# EasyEDA Pro project lceda_pro_3plus_2.4.epro

# Schematic sch_main_2
Create Date: 2023-11-15; Page Name: P1; Project Name: 多功能宏键盘 3Plus 【V2版本】; Schematic Name: sch_main_2; Update Date: 2023-11-27; Add into BOM: yes; Company: M0dular; Convert to PCB: yes; Drawed: 嘉立创EDA; Page Size: A3; Part Number: JLCPCB-001; Reviewed: 嘉立创EDA; Version: 2.4
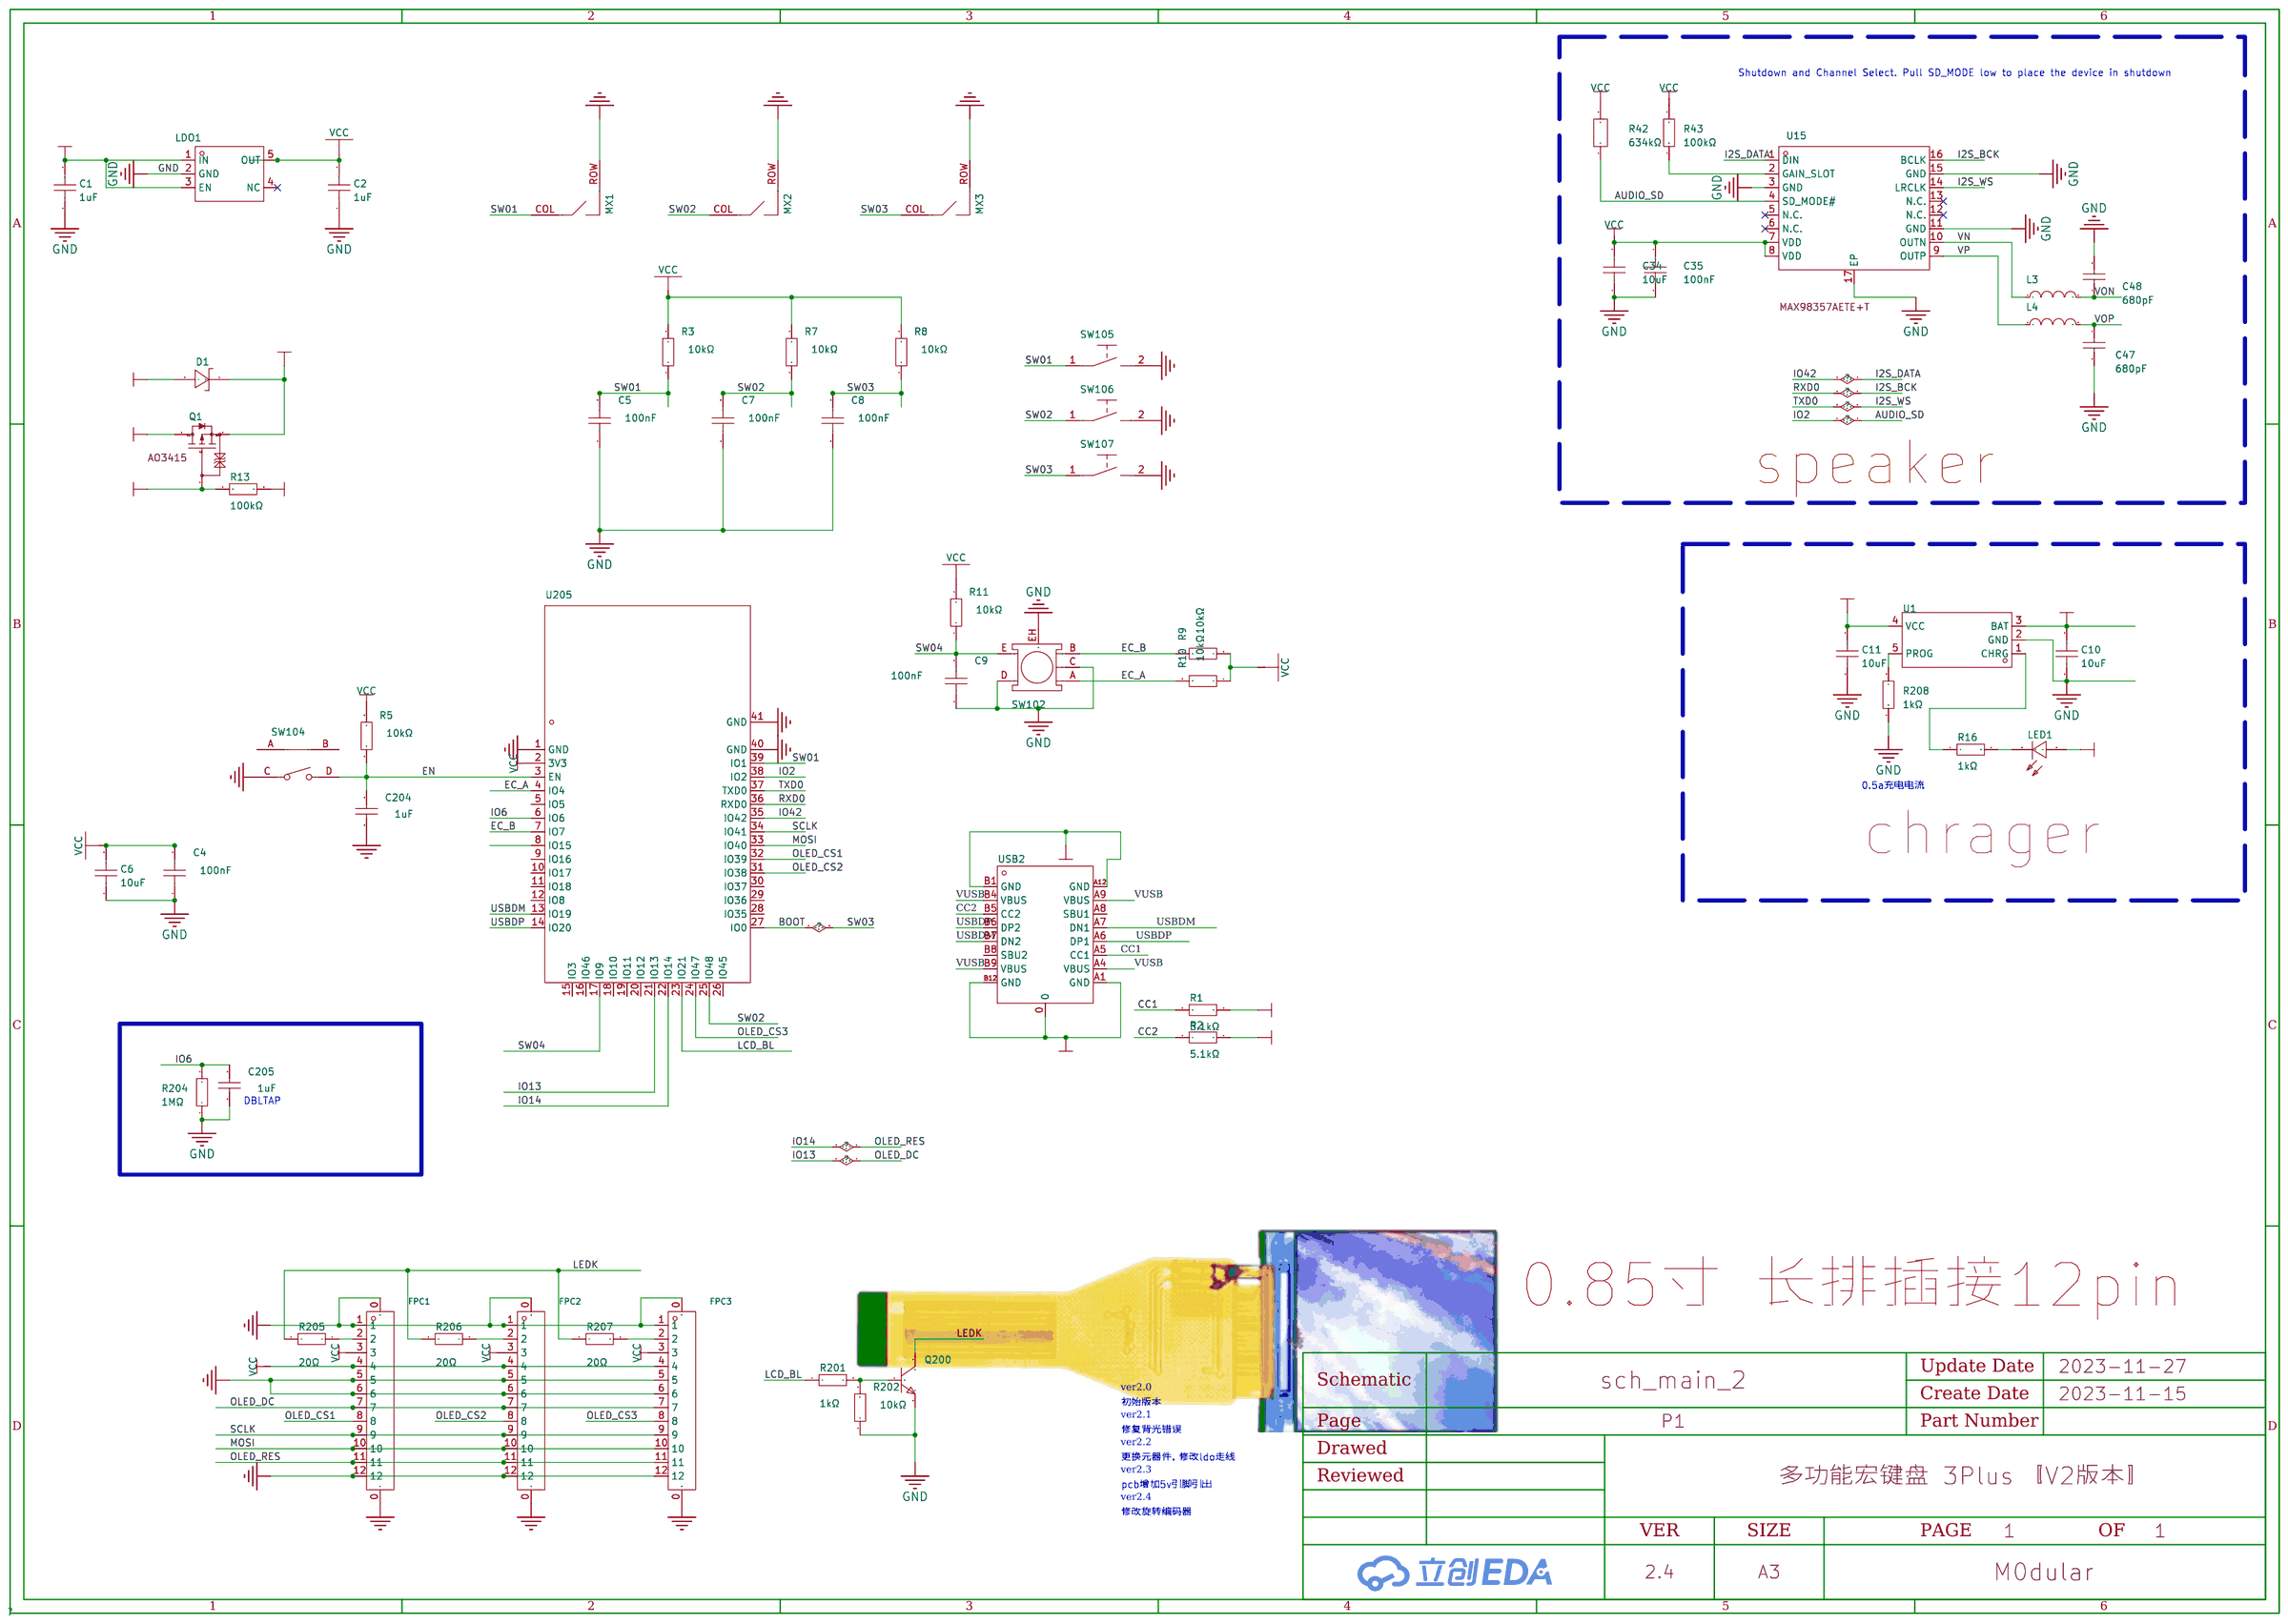
[diagram p0: schematic sheet]

## Parts
C1  1uF  [C0603]
C2  1uF  [C0603]
C4  100nF  [C0603]
C5  100nF  [C0603]
C6  10uF  [C0603]
C7  100nF  [C0603]
C8  100nF  [C0603]
C9  100nF  [C0603]
C10  10uF  [C0603]
C11  10uF  [C0603]
C34  10uF  [C0603]
C35  100nF  [C0603]
C47  680pF  [C0603]
C48  680pF  [C0603]
C204  1uF  [C0603]
C205  1uF  [C0603]
D1  -  [sod-323_l1.8-w1.3-ls2.5-rd]
FPC1  AFC42-S12FMA-1H  [CONN-SMD_12P-P0.50_L3.1-W8.0]
FPC2  AFC42-S12FMA-1H  [CONN-SMD_12P-P0.50_L3.1-W8.0]
FPC3  AFC42-S12FMA-1H  [CONN-SMD_12P-P0.50_L3.1-W8.0]
L3  BLM18SG331TN1D  [L0603]
L4  BLM18SG331TN1D  [L0603]
LDO1  TLV75733PDBVR  [SOT-23-5_L3.0-W1.7-P0.95-LS2.8-BR]
LED1  -  [LED0603-R-RD]
MX1  CPG151101S11-16  [CherryMX(KHS)-1.00U]
MX2  CPG151101S11-16  [CherryMX(KHS)-1.00U]
MX3  CPG151101S11-16  [CherryMX(KHS)-1.00U]
Q1  -  [sot-23-3_l2.9-w1.3-p1.90-ls2.4-br]
Q200  -  [SOT-23-3_L2.9-W1.3-P1.90-LS2.4-BR]
R1  5.1kΩ  [R0603]
R2  5.1kΩ  [R0603]
R3  10kΩ  [R0603]  (no BOM)
R5  10kΩ  [R0603]
R7  10kΩ  [R0603]  (no BOM)
R8  10kΩ  [R0603]  (no BOM)
R9  10kΩ  [R0603]
R10  10kΩ  [R0603]
R11  10kΩ  [R0603]  (no BOM)
R13  100kΩ  [R0603]
R16  1kΩ  [R0603]
R42  634kΩ  [R0603]
R43  100kΩ  [R0603]
R201  1kΩ  [R0603]
R202  10kΩ  [R0603]
R204  1MΩ  [R0603]
R205  20Ω  [R0603]
R206  20Ω  [R0603]
R207  20Ω  [R0603]
R208  1kΩ  [R0603]
SW102  EC11J1524413  [SW-SMD_EC11J1524413]
SW104  TS36CA-0.6  [SW-SMD_TS36CA]
SW105  CPG151101S13  [KEY-TH_CPG1511F01S0X]
SW106  CPG151101S13  [KEY-TH_CPG1511F01S0X]
SW107  CPG151101S13  [KEY-TH_CPG1511F01S0X]
U1  -  [SOT-23-5_L3.0-W1.7-P0.95-LS2.8-BR]
U15  MAX98357AETE+T  [TQFN-16_L3.0-W3.0-P0.50-BL-EP1.5]
U205  ESP32-S3-WROOM-1-N8R2  [WIRELM-SMD_ESP32-S3-WROOM-1]
USB2  -  [USB-C_SMD-TYPE-C-31-M-12]

## Library data of the parts
C1 C2 = CL10A105KB8NNNC: 容值:1uF;精度:±10%;额定电压:50V;材质(温度系数):X5R;; LCSC Part Name: 1uF ±10% 50V; Supplier Part: C15849; Manufacturer: SAMSUNG(三星); Supplier Footprint: 0603; JLCPCB Part Class: Basic Part; Datasheet: https://atta.szlcsc.com/upload/public/pdf/source/20160103/1457707679084.pdf; Supplier: LCSC; Tolerance: ±10%; Voltage Rated: 50V; Temperature Coefficient: X5R
C4 C5 C7-C9 = CL10B104KB8NNNC: 容值:100nF;精度:±10%;额定电压:50V;温度系数:X7R;; LCSC Part Name: 100nF ±10% 50V; Supplier Part: C1591; Manufacturer: SAMSUNG(三星); Supplier Footprint: 0603; JLCPCB Part Class: Extended Part; Datasheet: https://atta.szlcsc.com/upload/public/pdf/source/20160103/1457707680512.pdf; Supplier: LCSC; Tolerance: ±10%; Voltage Rated: 50V; Temperature Coefficient: X7R
C6 C10 C11 = CL10A106KP8NNNC: 容值:10uF;精度:±10%;额定电压:10V;温度系数:X5R;; LCSC Part Name: 10uF ±10% 10V; Supplier Part: C19702; Manufacturer: SAMSUNG(三星); Supplier Footprint: 0603; JLCPCB Part Class: Basic Part; Datasheet: https://atta.szlcsc.com/upload/public/pdf/source/20160103/1457707703378.pdf; Supplier: LCSC; Tolerance: ±10%; Voltage Rated: 10V; Temperature Coefficient: X5R
C34 = CL10A106KP8NNNC: 容值:10uF;精度:±10%;额定电压:10V;材质(温度系数):X5R;; LCSC Part Name: 10uF ±10% 10V; Supplier Part: C19702; Manufacturer: SAMSUNG(三星); Supplier Footprint: 0603; JLCPCB Part Class: Basic Part; Datasheet: https://atta.szlcsc.com/upload/public/pdf/source/20160103/1457707703378.pdf; Supplier: LCSC; Tolerance: ±10%; Voltage Rated: 10V; Temperature Coefficient: X5R
C35 = CL10B104KB8NNNC: 容值:100nF;精度:±10%;额定电压:50V;材质(温度系数):X7R;; LCSC Part Name: 100nF ±10% 50V; Supplier Part: C1591; Manufacturer: SAMSUNG(三星); Supplier Footprint: 0603; JLCPCB Part Class: Extended Part; Datasheet: https://atta.szlcsc.com/upload/public/pdf/source/20160218/1457707763339.pdf; Supplier: LCSC; Tolerance: ±10%; Voltage Rated: 50V; Temperature Coefficient: X7R
C47 C48 = 0603B681K500NT: 容值:680pF;精度:±10%;额定电压:50V;材质(温度系数):X7R;; LCSC Part Name: 680pF ±10% 50V; Supplier Part: C1630; Manufacturer: FH(风华); Supplier Footprint: 0603; JLCPCB Part Class: Basic Part; Datasheet: https://atta.szlcsc.com/upload/public/pdf/source/20170923/C1630_1506149298238988425.pdf; Supplier: LCSC; Tolerance: ±10%; Voltage Rated: 50V; Temperature Coefficient: X7R
C204 C205 = CL10A105KB8NNNC: 温度系数:X5R;精度:±10%;额定电压:50V;容值:1uF;; LCSC Part Name: 1uF(105) ±10% 50V; Supplier Part: C15849; Manufacturer: SAMSUNG(三星); Supplier Footprint: 0603; JLCPCB Part Class: Basic Part; Datasheet: https://atta.szlcsc.com/upload/public/pdf/source/20160103/1457707679084.pdf; Supplier: LCSC; Temperature Coefficient: X5R; Tolerance: ±10%; Voltage Rated: 50V
D1 = 1N5819WS: 直流反向耐压(Vr):40V;平均整流电流(Io):1A;正向压降(Vf):600mV@1A;; LCSC Part Name: 40V 1A 600mV@1A; Supplier Part: C191023; Manufacturer: Hottech(合科泰); Supplier Footprint: SOD-323; JLCPCB Part Class: Basic Part; Datasheet: https://atta.szlcsc.com/upload/public/pdf/source/20180614/C191023_3C6A6398B911F3A4C23E7538EE054643.pdf; Supplier: LCSC; Reverse Voltage (Vr): 40V; Average Rectified Current (Io): 1A; Forward Voltage (Vf@If): 600mV@1A
FPC1-FPC3 = AFC42-S12FMA-1H: 间距:0.5mm;触点数量:12;锁定特性:翻盖式;安装类型:卧贴;触点类型:双侧触点/上下接;; LCSC Part Name: FFC FPC连接器 0.5MM间距 12P 前插后翻 H1.0mm 双面接 镀金; Supplier Part: C466532; Manufacturer: JS(钜硕电子); Supplier Footprint: SMD,P=0.5mm; JLCPCB Part Class: 扩展库; Supplier: LCSC; Pitch: 0.5mm; Number of Contacts: 12; Locking Feature: 翻盖式; Mounting Type: 卧贴; Contact Type: 双侧触点/上下接; Height Above Board: 1mm; FFC, FCB Thickness: 0.3mm
L3 L4 = BLM18SG331TN1D: 标称阻抗@测试频率:330Ω@100MHz;误差:±25%;直流电阻(RDC):70mΩ;; LCSC Part Name: 单路 0603磁珠 阻抗330Ω@100MHz; Supplier Part: C88989; Manufacturer: muRata(村田); Supplier Footprint: 0603; JLCPCB Part Class: Extended Part; Datasheet: https://atta.szlcsc.com/upload/public/pdf/source/20180326/C88989_E77110ECB70599E5C39DB4FE82EA7FD9.pdf; Supplier: LCSC; Impedance @ Frequency: 330Ω@100MHz; Tolerance: ±25%; DC Resistance: 70mΩ; Current Rating: 1.5A; Circuits: 1
LDO1 = TLV75733PDBVR: 输出类型:固定;输出极性:正;输出通道数:1;最大输入电压:5.5V;输出电压:3.3V;压差:475mV@(1A);输出电流:1A;电源纹波抑制比(PSRR):52dB;; LCSC Part Name: 正 Vin=5.5V Vout=3.3V 1A 52dB; Supplier Part: C485517; Manufacturer: TI(德州仪器); Supplier Footprint: SOT-23-5; JLCPCB Part Class: Extended Part; Datasheet: https://atta.szlcsc.com/upload/public/pdf/source/20200225/C485517_6B29D09EDAFD9A781E45EE8E3C6E09A4.pdf; Supplier: LCSC; Output Type: 固定; Output Polarity: 正; Number of Outputs: 1; Maximum Input Voltage: 5.5V; Output Voltage: 3.3V; Dropout Voltage: 475mV@(1A); Output Current: 1A; Power Supply Rejection Ratio (PSRR): 52dB; Power Supply Rejection Ratio (PRSS): 70dB@(1kHz),62dB@(10kHz)
LED1 = 19-217/R6C-AL1M2VY/3T: 发光颜色:红灯;二极管配置:-;透镜颜色:无色透明;主波长:617.5nm;峰值波长:632nm;色温:-;光通量(25时):-;测试电流:5mA;正向电压(VF):2.2V;发光强度:28.5mcd;功率:60mW;发光角度:120°;安装方式:-;工作温度:-40~+85;; LCSC Part Name: 红灯; Supplier Part: C72044; Manufacturer: EVERLIGHT(台湾亿光); Supplier Footprint: 0603; JLCPCB Part Class: Extended Part; Datasheet: https://atta.szlcsc.com/upload/public/pdf/source/20160507/1462613613821.pdf; Supplier: LCSC; Emitted Color: 红灯; Lens Color: 无色透明; Dominant Wavelength: 617.5nm; Peak Wavelength: 632nm; Forward Current: 5mA; Forward Voltage (VF): 2.2V; Luminous Intensity: 28.5mcd; Power Dissipation: 60mW; Viewing Angle: 120°; Operating Temperature: -40~+85
MX1-MX3 = CPG151101S11-16: 轴类型:-;工作电压:2V~12V;操作力:-;触底力:-;触发行程:-;总行程:-;针脚数:-;机械寿命:-;工作温度:-;; Supplier Part: C5156480; Manufacturer: Kailh(凯华); JLCPCB Part Class: Extended Part; Datasheet: https://atta.szlcsc.com/upload/public/pdf/source/20220829/33DFC1A320A078D20879F2B21562B513.pdf; Supplier: LCSC; Operating Voltage: 2V~12V
Q1 = AO3415_C181094: 类型:P沟道;漏源电压(Vdss):20V;连续漏极电流(Id):4A;功率(Pd):1.5W;导通电阻(RDS(on)@Vgs,Id):41mΩ@4.5V,4A;阈值电压(Vgs(th)@Id):900mV@250A;; LCSC Part Name: P沟道 20V 4A; Supplier Part: C181094; Manufacturer: Hottech(合科泰); Manufacturer Part: AO3415; Supplier Footprint: SOT-23(SOT-23-3); JLCPCB Part Class: Extended Part; Datasheet: https://atta.szlcsc.com/upload/public/pdf/source/20180131/C181094_15173931965481329223.pdf; Supplier: LCSC; Type: P沟道; Drain Source Voltage (Vdss): 20V; Continuous Drain Current (Id): 4A; Power Dissipation (Pd): 1.5W; Drain Source On Resistance (RDS(on)@Vgs,Id): 41mΩ@4.5V,4A; Gate Threshold Voltage (Vgs(th)@Id): 900mV@250A
Q200 = SS8050 Y1 200-350 .: 集电极电流(Ic):1.5A;功率(Pd):300mW;晶体管类型:NPN;集射极击穿电压(Vceo):25V;; LCSC Part Name: SS8050Y1200-350.; Supplier Part: C2150; Manufacturer: CJ（江苏长电/长晶）; Manufacturer Part: SS8050; LCSC Stock: 138539; LCSC On Sale: 1; Supplier Footprint: SOT-23(SOT-23-3); Price: 0.126; JLCPCB Part Class: BasicPart; JLCPCB Stock: 708469; JLCPCB On Sale: 1; Datasheet: https://atta.szlcsc.com/upload/public/pdf/source/20140809/1457707209319.pdf; Supplier: LCSC; Collector Current (Ic): 1.5A; Power Dissipation (Pd): 300mW; Transistor Type: NPN; Collector-Emitter Breakdown Voltage (Vceo): 25V
R1 R2 = 0603WAF5101T5E: 电阻类型:厚膜电阻;阻值:5.1kΩ;精度:±1%;功率:1/10W;温度系数:±100ppm/;最大工作电压:75V;工作温度范围:-55~+155;; LCSC Part Name: 5.1kΩ ±1%; Supplier Part: C23186; Manufacturer: UNI-ROYAL(厚声); Supplier Footprint: 0603; JLCPCB Part Class: Basic Part; Datasheet: https://atta.szlcsc.com/upload/public/pdf/source/20200306/C422600_1E6D84923E4A46A82E41ADD87F860B5C.pdf; Supplier: LCSC; Type: 厚膜电阻; Tolerance: ±1%; Power(Watts): 1/10W; Temperature Coefficient: ±100ppm/; Overload Voltage (Max): 75V; Operating Temperature Range: -55~+155
R3 R5 R7-R11 = 0603WAF1002T5E: 电阻类型:厚膜电阻;阻值:10kΩ;精度:±1%;功率:1/10W;温度系数:±100ppm/;最大工作电压:75V;工作温度范围:-55~+155;; LCSC Part Name: 10kΩ ±1% 1/10W; Supplier Part: C25804; Manufacturer: UNI-ROYAL(厚声); Supplier Footprint: 0603; JLCPCB Part Class: Basic Part; Datasheet: https://atta.szlcsc.com/upload/public/pdf/source/20200306/C422600_1E6D84923E4A46A82E41ADD87F860B5C.pdf; Supplier: LCSC; Type: 厚膜电阻; Tolerance: ±1%; Power(Watts): 1/10W; Temperature Coefficient: ±100ppm/; Overload Voltage (Max): 75V; Operating Temperature Range: -55~+155
R13 R43 = 0603WAF1003T5E: 精度:±1%;阻值:100kΩ;温度系数:±100ppm/;功率:1/10W;最大工作电压:75V;工作温度范围:-55~+155;; LCSC Part Name: 100KΩ ±1%; Supplier Part: C25803; Manufacturer: UNI-ROYAL(厚声); Supplier Footprint: 0603; JLCPCB Part Class: Basic Part; Datasheet: https://atta.szlcsc.com/upload/public/pdf/source/20170920/C25803_1505901551039983376.pdf; Supplier: LCSC; Tolerance: ±1%; Temperature Coefficient: ±100ppm/; Power(Watts): 1/10W; Overload Voltage (Max): 75V; Operating Temperature Range: -55~+155
R16 R201 R208 = 0603WAF1001T5E: 电阻类型:厚膜电阻;阻值:1kΩ;精度:±1%;功率:1/10W;温度系数:±100ppm/;最大工作电压:75V;工作温度范围:-55~+155;; LCSC Part Name: 1kΩ ±1% 1/10W; Supplier Part: C21190; Manufacturer: UNI-ROYAL(厚声); Supplier Footprint: 0603; JLCPCB Part Class: Basic Part; Datasheet: https://atta.szlcsc.com/upload/public/pdf/source/20200306/C422600_1E6D84923E4A46A82E41ADD87F860B5C.pdf; Supplier: LCSC; Type: 厚膜电阻; Tolerance: ±1%; Power(Watts): 1/10W; Temperature Coefficient: ±100ppm/; Overload Voltage (Max): 75V; Operating Temperature Range: -55~+155
R42 = RC0603FR-07634KL: 电阻类型:厚膜电阻;阻值:634kΩ;精度:±1%;功率:100mW;; LCSC Part Name: 634kΩ ±1% 100mW; Supplier Part: C273753; Manufacturer: YAGEO(国巨); Supplier Footprint: 0603; JLCPCB Part Class: Extended Part; Datasheet: https://atta.szlcsc.com/upload/public/pdf/source/20191125/C273753_901BC2F8FEE117E6429E5D997CD78CF2.pdf; Supplier: LCSC; Type: 厚膜电阻; Tolerance: ±1%; Power(Watts): 100mW; Temperature Coefficient: ±100ppm/℃; Overload Voltage (Max): 75V; Operating Temperature Range: -55℃~+155℃
R202 = 0603WAF1002T5E: 电阻类型:厚膜电阻;阻值:10kΩ;精度:±1%;功率:100mW;; LCSC Part Name: 厚膜电阻 10kΩ ±1% 100mW; Supplier Part: C25804; Manufacturer: UNI-ROYAL(厚声); Supplier Footprint: 0603; JLCPCB Part Class: Basic Part; Datasheet: https://atta.szlcsc.com/upload/public/pdf/source/20200306/C422600_1E6D84923E4A46A82E41ADD87F860B5C.pdf; Supplier: LCSC; Type: 厚膜电阻; Tolerance: ±1%; Power(Watts): 100mW; Temperature Coefficient: ±100ppm/℃; Overload Voltage (Max): 75V; Operating Temperature Range: -55℃~+155℃
R204 = 0603WAF1004T5E: 电阻类型:厚膜电阻;阻值:1MΩ;精度:±1%;功率:100mW;; LCSC Part Name: 1MΩ ±1% 100mW; Supplier Part: C22935; Manufacturer: UNI-ROYAL(厚声); Supplier Footprint: 0603; JLCPCB Part Class: 基础库; Datasheet: https://atta.szlcsc.com/upload/public/pdf/source/20200306/C422600_1E6D84923E4A46A82E41ADD87F860B5C.pdf; Supplier: LCSC; Type: 厚膜电阻; Tolerance: ±1%; Power(Watts): 100mW; Temperature Coefficient: ±100ppm/℃; Overload Voltage (Max): 75V; Operating Temperature Range: -55℃~+155℃
R205-R207 = 0603WAF200JT5E: 电阻类型:厚膜电阻;阻值:20Ω;精度:±1%;功率:100mW;温度系数:±100ppm/℃;; LCSC Part Name: 厚膜电阻 20Ω ±1% 100mW; Supplier Part: C22950; Manufacturer: UNI-ROYAL(厚声); Supplier Footprint: 0603; JLCPCB Part Class: Basic Part; Datasheet: https://atta.szlcsc.com/upload/public/pdf/source/20200306/C422600_1E6D84923E4A46A82E41ADD87F860B5C.pdf; Supplier: LCSC; Type: 厚膜电阻; Tolerance: ±1%; Power(Watts): 100mW; Temperature Coefficient: ±100ppm/℃; Overload Voltage (Max): 75V; Operating Temperature Range: -55℃~+155℃
SW102 = EC11J1524413: Supplier Part: C470592; Manufacturer: ALPSALPINE(阿尔卑斯阿尔派); Supplier Footprint: SMD; JLCPCB Part Class: 扩展库; Datasheet: https://atta.szlcsc.com/upload/public/pdf/source/20191216/C470795_DE763ECE59BD49533DB26DB53E5D34B2.pdf; Supplier: LCSC
SW104 = TS36CA-0.6: 触点电流:50mA;额定电压(DC):12V;绝缘电阻:100MΩ;电路结构:单刀单掷;安装方式:卧贴;按钮形状:矩形按钮;按钮/盖帽颜色:黑色;作用力:250gf@±50gf;机械寿命:30000;工作温度:-20℃~+70℃;引脚样式:SMD接片;开关高度:3.5mm;; LCSC Part Name: 轻触开关 3*6*3.5侧按 直径0.6定位柱 白体黑头 250力度; Supplier Part: C2681481; Manufacturer: SHOU HAN(首韩); Supplier Footprint: SMD; JLCPCB Part Class: 扩展库; Datasheet: https://atta.szlcsc.com/upload/public/pdf/source/20210122/C2681481_EC49E45AE97AC1474E58FB36E84EF19B.pdf; Supplier: LCSC; Contact Current: 50mA; Voltage Rating (DC): 12V; Insulation Resistance: 100MΩ; Circuit: 单刀单掷; Mounting Style: 卧贴; Actuator Style: 矩形按钮; Actuator/Cap Color: 黑色; Operating Force: 250gf@±50gf; Mechanical Life: 30000; Operating Temperature: -20℃~+70℃; Pin Style: SMD接片; Switch Height: 3.5mm
SW105-SW107 = CPG151101S13: 轴类型:青轴;工作电压:2V~12V;操作力:50gf@±10gf;针脚数:2;; LCSC Part Name: KT 青轴; Supplier Part: C404353; Manufacturer: Kailh(凯华); Supplier Footprint: 插件; JLCPCB Part Class: 扩展库; Datasheet: https://atta.szlcsc.com/upload/public/pdf/source/20190830/C404353_03D773C25064FB6981E6251E455188E4.pdf; Supplier: LCSC; Axis Type: 青轴; Operating Voltage: 2V~12V; Operation Force: 50gf@±10gf; Tactile Force: 60gf@±10gf; Conduction Travel: 1.9mm; Total Travel: 4mm; Pin: 2; Mechanical Life: 7000万次; Operating Temperature: -10℃~+70℃
U1 = TP4054-42-SOT25R: 充电电池的类型:-;电池单元组数:-;最大充电电流:-;充满的电池组电压:-;最大供应电压:-;; Supplier Part: C32574; Manufacturer: TOPPOWER(南京拓微); Supplier Footprint: SOT-23-5; JLCPCB Part Class: Basic Part; Datasheet: https://atta.szlcsc.com/upload/public/pdf/source/20140621/1457707095588.pdf; Supplier: LCSC
U15 = MAX98357AETE+T: 功放类型:-;输出功率:-;; Supplier Part: C910544; Manufacturer: ADI(亚德诺)/MAXIM(美信); Supplier Footprint: TQFN-16-EP(3x3); JLCPCB Part Class: Extended Part; Datasheet: https://atta.szlcsc.com/upload/public/pdf/source/20210106/C910544_CB6DE4B2CEE254A72E6BDB40E718D281.pdf; Supplier: LCSC
U205 = ESP32-S3-WROOM-1-N8R2: Supplier Part: C2913204; Manufacturer: ESPRESSIF(乐鑫); Supplier Footprint: SMD,18x25.5mm; JLCPCB Part Class: Extended Part; Datasheet: https://atta.szlcsc.com/upload/public/pdf/source/20220628/A2AC12B3C87735CAEB7EBE2DBE80936C.pdf; Supplier: LCSC
USB2 = USB-TYPE-C-018: 连接器类型:Type-C;标准:-;公母:母座;触点数量:16;端口数量:1;安装方式:卧贴;额定电流 - 电源:3A;工作温度范围:-25~+85;; Supplier Part: C2927038; Manufacturer: DEALON(德艺隆); Supplier Footprint: SMD; JLCPCB Part Class: Extended Part; Datasheet: https://atta.szlcsc.com/upload/public/pdf/source/20211217/CCD3D517E355E8E0CC52ABD8D5784AD8.pdf; Supplier: LCSC; Connector Type: Type-C; Gender: 母座; Number of Contacts: 16; Number of Ports: 1; Mounting Style: 卧贴; Current Rating - Power (Max): 3A; Operating Temperature Range: -25~+85

## Nets
GND: C1.1 C2.1 C4.1 C5.1 C6.1 C7.1 C8.1 C9.1 C10.1 C11.1 C34.1 C35.2 C47.1 C48.2 C204.1 C205.1 FPC1.0 FPC1.1 FPC1.5 FPC1.6 FPC1.12 FPC2.0 FPC2.1 FPC2.5 FPC2.6 FPC2.12 FPC3.0 FPC3.1 FPC3.5 FPC3.6 FPC3.12 LDO1.2(GND) MX1.ROW MX2.ROW MX3.ROW Q200.2(E) R1.2 R2.2 R13.2 R202.1 R204.1 R208.1 SW102.C SW102.D SW102.EH SW104.C SW105.2 SW106.2 SW107.2 U1.2(GND) U15.3(GND) U15.11(GND) U15.15(GND) U15.17(EP) U205.1(GND) U205.40(GND) U205.41(GND) USB2.0 USB2.A1(GND) USB2.A12(GND) USB2.B1(GND) USB2.B12(GND)
VBAT: C10.2 Q1.3(D) U1.3(BAT)
VCC: C2.2 C4.2 C6.2 C34.2 C35.1 FPC1.3 FPC1.4 FPC2.3 FPC2.4 FPC3.3 FPC3.4 LDO1.5(OUT) R3.2 R5.2 R7.2 R8.2 R9.1 R10.1 R11.2 R42.2 R43.2 U15.7(VDD) U15.8(VDD) U205.2(3V3)
AUDIO_SD: R42.1 U15.4(SD_MODE#) U205.38(IO2)
BOOT: C8.2 MX3.COL R8.1 SW107.1 U205.27(IO0)
CC1: R1.1 USB2.A5(CC1)
CC2: R2.1 USB2.B5(CC2)
EC_A: R10.2 SW102.A U205.4(IO4)
EC_B: R9.2 SW102.B U205.7(IO7)
EN: C204.2 R5.1 SW104.D U205.3(EN)
I2S_BCK: U15.16(BCLK) U205.36(RXD0)
I2S_DATA: U15.1(DIN) U205.35(IO42)
I2S_WS: U15.14(LRCLK) U205.37(TXD0)
IO6: C205.2 R204.2 U205.6(IO6)
IO13: FPC1.7 FPC2.7 FPC3.7 U205.21(IO13)
IO14: FPC1.11 FPC2.11 FPC3.11 U205.22(IO14)
LCD_BL: R201.1 U205.23(IO21)
LEDK: Q200.3(C) R205.1 R206.1 R207.1
MOSI: FPC1.10 FPC2.10 FPC3.10 U205.33(IO40)
OLED_CS1: FPC1.8 U205.32(IO39)
OLED_CS2: FPC2.8 U205.31(IO38)
OLED_CS3: FPC3.8 U205.24(IO47)
SCLK: FPC1.9 FPC2.9 FPC3.9 U205.34(IO41)
SW01: C5.2 MX1.COL R3.1 SW105.1 U205.39(IO1)
SW02: C7.2 MX2.COL R7.1 SW106.1 U205.25(IO48)
SW04: C9.2 R11.1 SW102.E U205.17(IO9)
USBDM: U205.13(IO19) USB2.A7(DN1) USB2.B7(DN2)
USBDP: U205.14(IO20) USB2.A6(DP1) USB2.B6(DP2)
VN: L3.1 U15.10(OUTN)
VON: C48.1 L3.2
VOP: C47.2 L4.2
VP: L4.1 U15.9(OUTP)
VSYS: C1.2 D1.1(C) LDO1.1(IN) LDO1.3(EN) Q1.2(S)
VUSB: C11.2 D1.2(A) LED1.1(A) Q1.1(G) R13.1 U1.4(VCC) USB2.A4(VBUS) USB2.A9(VBUS) USB2.B4(VBUS) USB2.B9(VBUS)
$1N48640: R208.2 U1.5(PROG)
$1N76182: R16.1 U1.1(CHRG)
$1N95276: Q200.1(B) R201.2 R202.2
$1N109191: R43.1 U15.2(GAIN_SLOT)
$1N112073: LED1.2(C) R16.2
$1N122714: FPC3.2 R207.2
$1N122760: FPC2.2 R206.2
$1N122794: FPC1.2 R205.2

Not connected (* = marked no-connect by the designer): LDO1 4(NC)*; SW104 A B; U15 5(N.C.)* 6(N.C.)* 12(N.C.)* 13(N.C.)*; U205 5(IO5) 8(IO15) 9(IO16) 10(IO17) 11(IO18) 12(IO8) 15(IO3) 16(IO46) 18(IO10) 19(IO11) 20(IO12) 26(IO45) 28(IO35) 29(IO36) 30(IO37); USB2 A8(SBU1) B8(SBU2)

## Notes on the sheet
- Shutdown and Channel Select. Pull SD_MODE low to place the device in shutdown
- speaker
- 0.5a充电电流
- chrager
- DBLTAP
- 0.85寸 长排插接12pin
- ver2.0
- 初始版本
- ver2.1
- 修复背光错误
- ver2.2
- 更换元器件，修改ldo走线
- pcb增加5v引脚引出
- ver2.3
- ver2.4
- 修改旋转编码器

# Board pcb_main_2
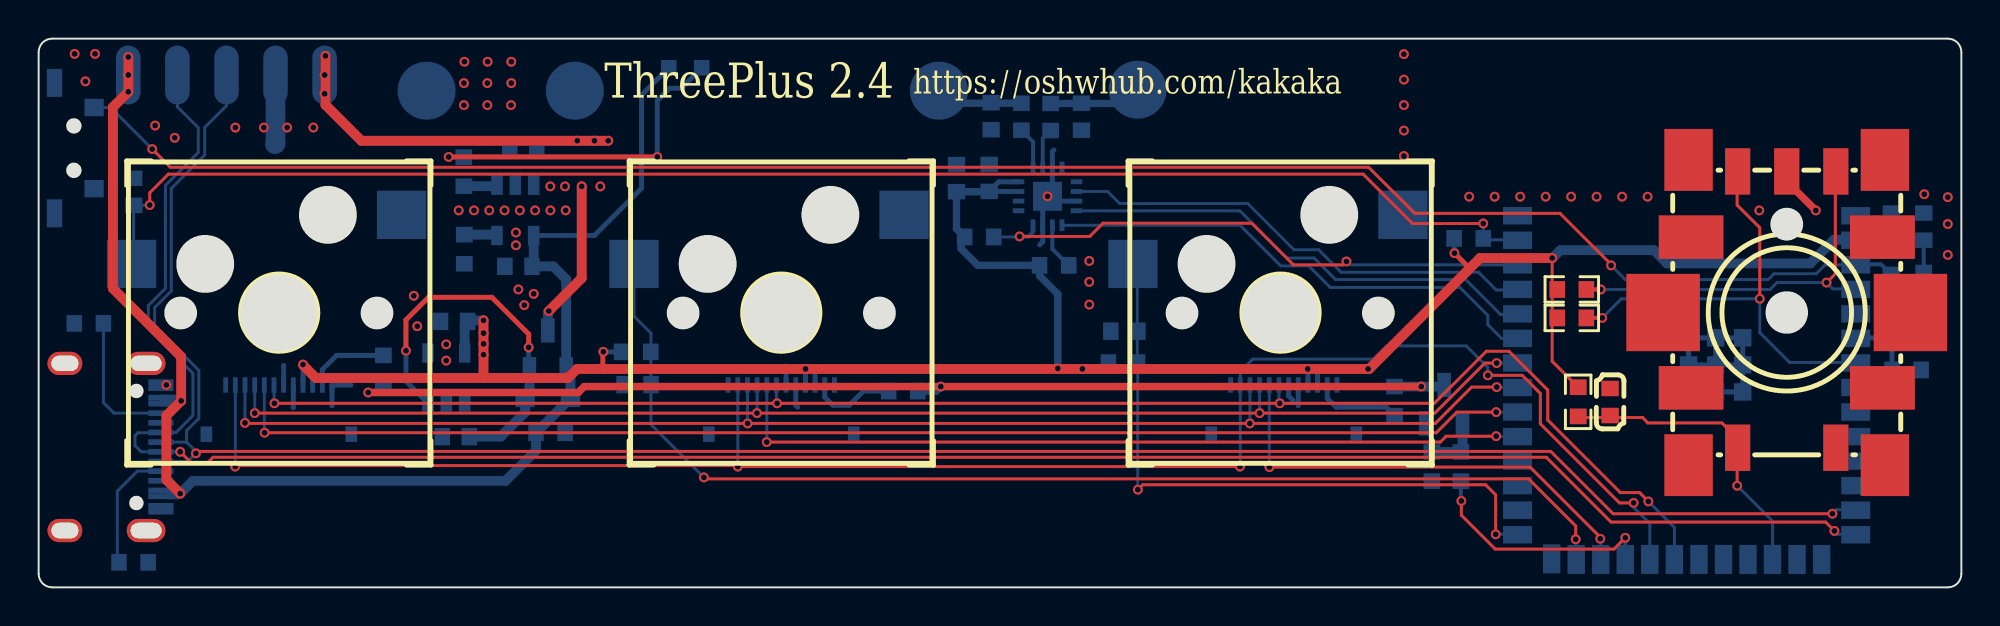
[diagram p1: board, top side]
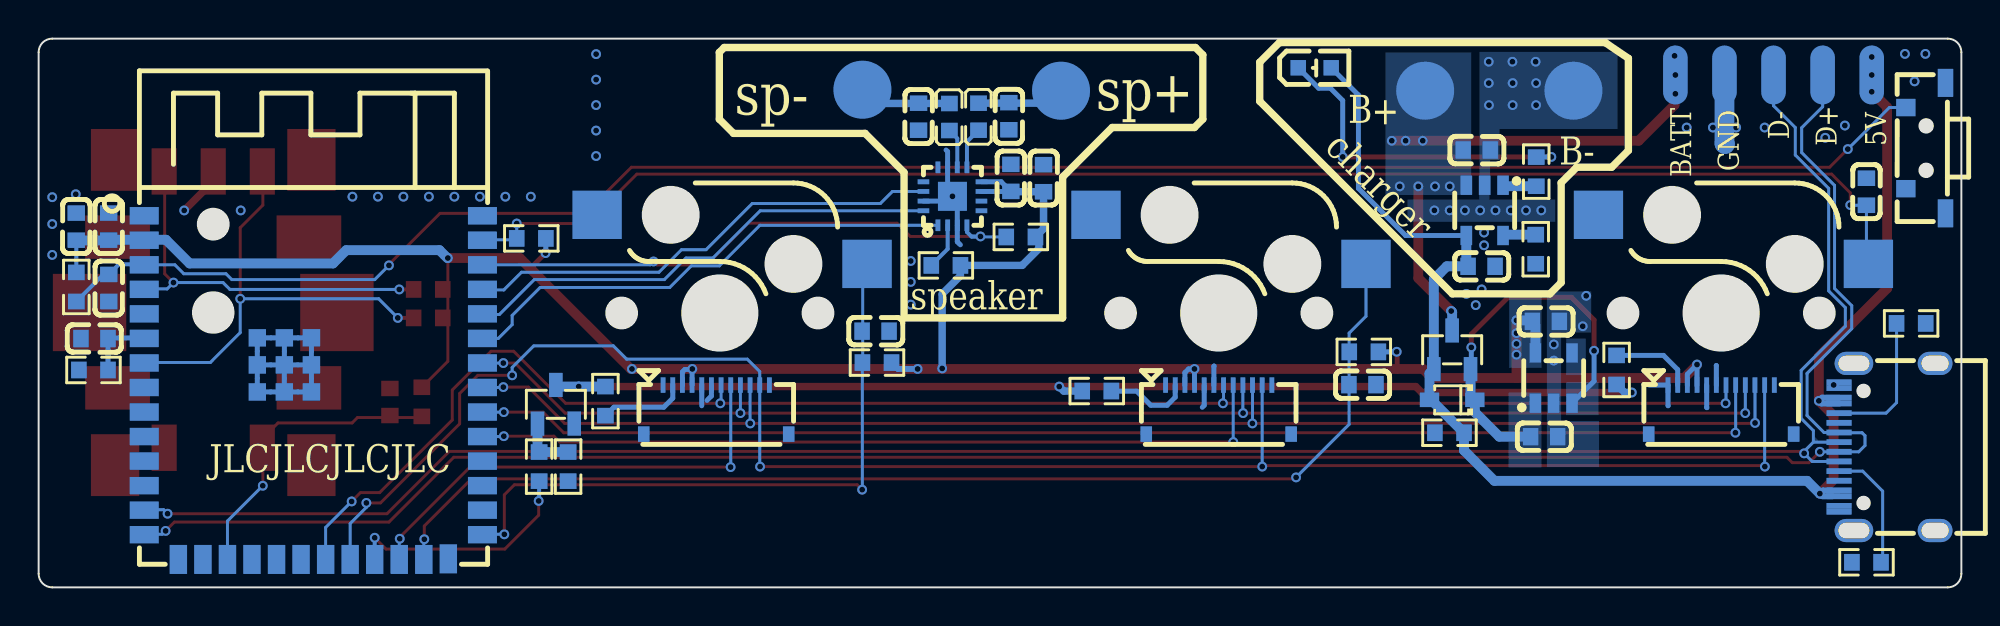
[diagram p2: board, bottom side, seen from below]

Outline 99.49 x 28.4 mm; copper layers: Top Layer, Bottom Layer. Coordinates in mm from the lower left corner of the outline.
Outline path: 0,27.7 arc(0.21,28.19) 0.7,28.4 98.79,28.4 arc(99.29,28.19) 99.49,27.7 99.49,0.7 arc(99.29,0.21) 98.79,0 0.7,0 arc(0.21,0.21) 0,0.7 0,27.7
Stack: Top Layer 0.035mm / Dielectric1 1.51mm FR4 er 4.5 / Bottom Layer 0.035mm

## Design rules (mm)
spacing safeClearance (default): track to track 0.152, other pairs 0.152 to 0.3
track width trackWidth (default): min 0.127, default 0.254, max 2.54
differential pair differentialPair (default): width min 0.127, default 0.254, max 2.54; gap min 0.152, default 0.152
via viaSize (default): diameter min 0.5, default 0.61, max 10; hole min 0.3, default 0.305, max 6

## Placement (name value [footprint] x y rotation side)
C1  1uF  [C0603]  21.58 7.8 0 bottom
C2  1uF  [C0603]  21.5 13.77 0 bottom
C4  100nF  [C0603]  95.87 18.67 270 bottom
C5  100nF  [C0603]  4.91 20.47 270 bottom
C6  10uF  [C0603]  97.54 18.67 270 bottom
C7  100nF  [C0603]  30.99 10.49 0 bottom
C8  100nF  [C0603]  56.18 13.26 0 bottom
C9  100nF  [C0603]  81.31 9.59 270 top
C10  10uF  [C0603]  25.08 22.63 0 bottom
C11  10uF  [C0603]  24.83 16.62 0 bottom
C34  10uF  [C0603]  47.49 21.18 270 bottom
C35  100nF  [C0603]  49.18 21.19 90 bottom
C47  680pF  [C0603]  49.29 24.39 90 bottom
C48  680pF  [C0603]  53.96 24.36 270 bottom
C204  1uF  [C0603]  95.86 15.5 90 bottom
C205  1uF  [C0603]  96.6 12.88 180 bottom
D1  -  [sod-323_l1.8-w1.3-ls2.5-rd]  26.35 9.7 0 bottom
FPC1  AFC42-S12FMA-1H  [CONN-SMD_12P-P0.50_L3.1-W8.0]  12.43 9.2 180 bottom
FPC2  AFC42-S12FMA-1H  [CONN-SMD_12P-P0.50_L3.1-W8.0]  38.43 9.2 180 bottom
FPC3  AFC42-S12FMA-1H  [CONN-SMD_12P-P0.50_L3.1-W8.0]  64.43 9.2 180 bottom
L3  BLM18SG331TN1D  [L0603]  52.36 24.34 90 bottom
L4  BLM18SG331TN1D  [L0603]  50.86 24.36 90 bottom
LDO1  TLV75733PDBVR  [SOT-23-5_L3.0-W1.7-P0.95-LS2.8-BR]  21.09 10.83 270 bottom
LED1  -  [LED0603-R-RD]  33.46 26.89 180 bottom
MX1  CPG151101S11-16  [CherryMX(KHS)-1.00U]  12.43 14.2 0 top
MX2  CPG151101S11-16  [CherryMX(KHS)-1.00U]  38.43 14.2 0 top
MX3  CPG151101S11-16  [CherryMX(KHS)-1.00U]  64.24 14.2 0 top
NOREF  -  [Pad_e11]  12.26 26.52 0 top
NOREF#2  -  [Pad_e3529]  20.07 25.71 270 top
NOREF#3  -  [Pad_e14]  14.8 26.52 0 top
NOREF#4  -  [Pad_e1486]  46.59 25.71 0 top
NOREF#5  -  [Pad_e413]  7.18 26.52 0 top
NOREF#6  -  [Pad_e411]  9.72 26.52 0 top
NOREF#7  -  [Pad_e3530]  27.74 25.71 270 top
NOREF#8  -  [Pad_e7]  4.64 26.52 0 top
NOREF#9  -  [Pad_e1487]  56.86 25.76 0 top
Q1  -  [sot-23-3_l2.9-w1.3-p1.90-ls2.4-br]  26.35 12.29 270 bottom
Q200  -  [SOT-23-3_L2.9-W1.3-P1.90-LS2.4-BR]  72.73 9.48 270 bottom
R1  5.1kΩ  [R0603]  4.91 1.3 0 bottom
R2  5.1kΩ  [R0603]  2.6 13.66 180 bottom
R3  10kΩ  [R0603]  74 18.06 180 bottom
R5  10kΩ  [R0603]  97.54 15.55 90 bottom
R7  10kΩ  [R0603]  30.92 12.19 180 bottom
R8  10kΩ  [R0603]  56.11 11.63 180 bottom
R9  10kΩ  [R0603]  79.33 13.95 0 top
R10  10kΩ  [R0603]  79.33 15.42 0 top
R11  10kΩ  [R0603]  79.66 9.6 90 top
R13  100kΩ  [R0603]  26.49 8 0 bottom
R16  1kΩ  [R0603]  22 21.52 90 bottom
R42  634kΩ  [R0603]  48.67 18.14 180 bottom
R43  100kΩ  [R0603]  52.55 16.66 180 bottom
R201  1kΩ  [R0603]  73.59 6.25 90 bottom
R202  10kΩ  [R0603]  72.09 6.25 90 bottom
R204  1MΩ  [R0603]  96.65 11.25 180 bottom
R205  20Ω  [R0603]  17.84 11.25 90 bottom
R206  20Ω  [R0603]  44.74 10.16 180 bottom
R207  20Ω  [R0603]  70.16 9.64 270 bottom
R208  1kΩ  [R0603]  22.02 17.5 90 bottom
SW102  EC11J1524413  [SW-SMD_EC11J1524413]  90.46 14.23 180 top
SW104  TS36CA-0.6  [SW-SMD_TS36CA]  1.85 22.73 90 bottom
SW105  CPG151101S13  [KEY-TH_CPG1511F01S0X]  11.81 18.03 0 top
SW106  CPG151101S13  [KEY-TH_CPG1511F01S0X]  37.79 18.03 0 top
SW107  CPG151101S13  [KEY-TH_CPG1511F01S0X]  63.63 18.03 0 top
U1  -  [SOT-23-5_L3.0-W1.7-P0.95-LS2.8-BR]  24.67 19.51 90 bottom
U15  MAX98357AETE+T  [TQFN-16_L3.0-W3.0-P0.50-BL-EP1.5]  52.21 20.24 180 bottom
U205  ESP32-S3-WROOM-1-N8R2  [WIRELM-SMD_ESP32-S3-WROOM-1]  85.28 10.34 180 bottom
USB2  -  [USB-C_SMD-TYPE-C-31-M-12]  3.84 7.27 90 bottom

## Footprints (pads in the part's own frame, mm; a bottom-side part is the same pattern mirrored in y, then rotated)
C0603
  rect 0.8x0.9 smd: 1(-0.7,0) 2(0.7,0)
CherryMX(KHS)-1.00U
  rect 2.55x2.499 smd far side: COL(-7.62,2.54) ROW(6.35,5.08)
CONN-SMD_12P-P0.50_L3.1-W8.0
  rect 0.6x0.8 smd: 0(-3.75,-1.27) 0(3.75,-1.27)
  rect 0.25x0.8 smd: 1(-2.75,1.27) 2(-2.25,1.27) 3(-1.75,1.27) 4(-1.25,1.27) 5(-0.75,1.27) 6(-0.25,1.27) 7(0.25,1.27) 8(0.75,1.27) 9(1.25,1.27) 10(1.75,1.27) 11(2.25,1.27) 12(2.75,1.27)
L0603
  rect 0.8x0.864 smd: 1(-0.7,0) 2(0.7,0)
LED0603-R-RD
  rect 0.8x0.8 smd: 1(0.851,0) 2(-0.851,0)
Pad_e7
  oval 1.27x3.048 smd far side: 42(0,0)
Pad_e11
  oval 1.27x3.048 smd far side: 43(0,0)
Pad_e14
  oval 1.27x3.048 smd far side: 44(0,0)
Pad_e411
  oval 1.27x3.048 smd far side: 43(0,0)
Pad_e413
  oval 1.27x3.048 smd far side: 42(0,0)
Pad_e1486
  round 3 smd far side: 1(0,0)
Pad_e1487
  round 3 smd far side: 2(0,0)
Pad_e3529
  round 3 smd far side: 1(0,0)
Pad_e3530
  round 3 smd far side: 2(0,0)
R0603
  rect 0.806x0.864 smd: 1(-0.753,0) 2(0.753,0)
sod-323_l1.8-w1.3-ls2.5-rd
  rect 1.001x0.75 smd: 1(-1.173,0) 2(1.173,0)
sot-23-3_l2.9-w1.3-p1.90-ls2.4-br
  rect 1.25x0.701 smd: 1(1.001,-0.95) 2(1.001,0.95) 3(-1.001,0)
SOT-23-3_L2.9-W1.3-P1.90-LS2.4-BR
  rect 1.25x0.7 smd: 1(1,-0.95) 2(1,0.95) 3(-1,0)
SOT-23-5_L3.0-W1.7-P0.95-LS2.8-BR
  rect 1.001x0.6 smd: 1(1.3,-0.95) 2(1.3,0) 3(1.3,0.95) 4(-1.3,0.95) 5(-1.3,-0.95)
SW-SMD_EC11J1524413
  rect 1.3x2.4 smd: A(-2.54,-7.3) B(2.54,-7.3) C(0,-7.3) D(-2.54,7) E(2.54,7)
  rect 3.8x4 smd: EH(-6.4,0) EH(6.4,0)
  rect 2.5x3.2 smd: EH(-5.08,7.9) EH(-5.08,-7.9) EH(5.08,7.9) EH(5.08,-7.9)
  rect 3.35x2.25 smd: EH(-4.95,3.9) EH(-4.95,-3.9) EH(4.95,3.9) EH(4.95,-3.9)
SW-SMD_TS36CA
  rect 1.45x0.8 smd: A(-3.375,-1.025) B(3.375,-1.025)
  rect 0.9x1 smd: C(-2.1,1.025) D(2.1,1.025)
TQFN-16_L3.0-W3.0-P0.50-BL-EP1.5
  rect 0.25x0.6 smd: 1(-0.749,-1.5) 2(-0.248,-1.5) 3(0.252,-1.5) 4(0.751,-1.5) 9(0.75,1.5) 10(0.25,1.5) 11(-0.25,1.5) 12(-0.749,1.5)
  rect 0.6x0.25 smd: 5(1.5,-0.748) 6(1.5,-0.248) 7(1.5,0.252) 8(1.5,0.752) 13(-1.5,0.752) 14(-1.5,0.252) 15(-1.5,-0.248) 16(-1.5,-0.748)
  rect 1.5x1.5 smd: 17(0,0)
USB-C_SMD-TYPE-C-31-M-12
  oval 1.2x1.8 hole 0.8x1.4: 0(-4.325,-2.484) 0(4.325,-2.484)
  oval 1.2x2 hole 0.8x1.6: 0(-4.325,1.716) 0(4.325,1.716)
  rect 0.3x1.3 smd: A1(-3.35,2.484) A4(-2.55,2.484) A5(-1.25,2.484) A6(-0.25,2.484) A7(0.25,2.484) A8(1.25,2.484) A9(2.55,2.484) A12(3.35,2.484) B1(3.05,2.484) B4(2.25,2.484) B5(1.75,2.484) B6(0.75,2.484) B7(-0.75,2.484) B8(-1.75,2.484) B9(-2.25,2.484) B12(-3.05,2.484)
WIRELM-SMD_ESP32-S3-WROOM-1
  rect 1.5x0.9 smd: 1(-8.75,8.895) 2(-8.75,7.625) 3(-8.75,6.355) 4(-8.75,5.085) 5(-8.75,3.815) 6(-8.75,2.545) 7(-8.75,1.275) 8(-8.75,0.005) 9(-8.75,-1.265) 10(-8.75,-2.535) 11(-8.75,-3.805) 12(-8.75,-5.075) 13(-8.75,-6.345) 14(-8.75,-7.615) 27(8.75,-7.615) 28(8.75,-6.345) 29(8.75,-5.075) 30(8.75,-3.805) 31(8.75,-2.535) 32(8.75,-1.265) 33(8.75,0.005) 34(8.75,1.275) 35(8.75,2.545) 36(8.75,3.815) 37(8.75,5.085) 38(8.75,6.355) 39(8.75,7.625) 40(8.75,8.895)
  rect 0.9x1.5 smd: 15(-6.985,-8.895) 16(-5.715,-8.895) 17(-4.445,-8.895) 18(-3.175,-8.895) 19(-1.905,-8.895) 20(-0.635,-8.895) 21(0.635,-8.895) 22(1.905,-8.895) 23(3.175,-8.895) 24(4.445,-8.895) 25(5.715,-8.895) 26(6.985,-8.865)
  rect 0.9x0.9 smd: 41(-2.9,-0.225) 41(-2.9,1.175) 41(-2.9,2.575) 41(-1.5,-0.225) 41(-1.5,1.175) 41(-1.5,2.575) 41(-0.1,-0.225) 41(-0.1,1.175) 41(-0.1,2.575)

## Nets
GND: C1.1 C2.1 C4.1 C5.1 C6.1 C7.1 C8.1 C9.1 C10.1 C11.1 C34.1 C35.2 C47.1 C48.2 C204.1 C205.1 FPC1.0 FPC1.1 FPC1.5 FPC1.6 FPC1.12 FPC2.0 FPC2.1 FPC2.5 FPC2.6 FPC2.12 FPC3.0 FPC3.1 FPC3.5 FPC3.6 FPC3.12 LDO1.2 MX1.ROW MX2.ROW MX3.ROW NOREF.43 NOREF#2.1 Q200.2 R1.2 R2.2 R13.2 R202.1 R204.1 R208.1 SW102.C SW102.D SW102.EH SW104.C U1.2 U15.3 U15.11 U15.15 U15.17 U205.1 U205.40 U205.41 USB2.0 USB2.A1 USB2.A12 USB2.B1 USB2.B12
VBAT: C10.2 NOREF#3.44 NOREF#7.2 Q1.3 U1.3
VCC: C2.2 C4.2 C6.2 C34.2 C35.1 FPC1.3 FPC1.4 FPC2.3 FPC2.4 FPC3.3 FPC3.4 LDO1.5 R3.2 R5.2 R7.2 R8.2 R9.1 R10.1 R11.2 R42.2 R43.2 U15.7 U15.8 U205.2
AUDIO_SD: R42.1 U15.4 U205.38
BOOT: C8.2 MX3.COL R8.1 U205.27
CC1: R1.1 USB2.A5
CC2: R2.1 USB2.B5
EC_A: R10.2 SW102.A U205.4
EC_B: R9.2 SW102.B U205.7
EN: C204.2 R5.1 SW104.D U205.3
I2S_BCK: U15.16 U205.36
I2S_DATA: U15.1 U205.35
I2S_WS: U15.14 U205.37
IO6: C205.2 R204.2 U205.6
IO13: FPC1.7 FPC2.7 FPC3.7 U205.21
IO14: FPC1.11 FPC2.11 FPC3.11 U205.22
LCD_BL: R201.1 U205.23
LEDK: Q200.3 R205.1 R206.1 R207.1
MOSI: FPC1.10 FPC2.10 FPC3.10 U205.33
OLED_CS1: FPC1.8 U205.32
OLED_CS2: FPC2.8 U205.31
OLED_CS3: FPC3.8 U205.24
SCLK: FPC1.9 FPC2.9 FPC3.9 U205.34
SW01: C5.2 MX1.COL R3.1 U205.39
SW02: C7.2 MX2.COL R7.1 U205.25
SW04: C9.2 R11.1 SW102.E U205.17
USBDM: NOREF#6.43 U205.13 USB2.A7 USB2.B7
USBDP: NOREF#5.42 U205.14 USB2.A6 USB2.B6
VN: L3.1 U15.10
VON: C48.1 L3.2 NOREF#9.2
VOP: C47.2 L4.2 NOREF#4.1
VP: L4.1 U15.9
VSYS: C1.2 D1.1 LDO1.1 LDO1.3 Q1.2
VUSB: C11.2 D1.2 LED1.1 NOREF#8.42 Q1.1 R13.1 U1.4 USB2.A4 USB2.A9 USB2.B4 USB2.B9
$1N48640: R208.2 U1.5
$1N76182: R16.1 U1.1
$1N95276: Q200.1 R201.2 R202.2
$1N105027: U205.8
$1N109191: R43.1 U15.2
$1N112073: LED1.2 R16.2
$1N122714: FPC3.2 R207.2
$1N122760: FPC2.2 R206.2
$1N122794: FPC1.2 R205.2

Pads without a net: LDO1 4; SW104 A B; U15 5 6 12 13; U205 5 9 10 11 12 15 16 18 19 20 26 28 29 30; USB2 A8 B8

## Via types
v1: diameter 0.508, hole 0.305, Top Layer to Bottom Layer, 139 vias

## Routing (per net, layer and track width the routed paths; a pad name or vN(x,y) marks a point on that pad's centre or on a via; arc(x,y) is an arc through that point)
GND: length 37.9
  Top Layer w0.381: v1(91.96,19.51) 90.43,21.04 90.43,21.5
  Bottom Layer w0.254: U205.41 U205.41 ; U205.41 U205.41 U205.41 ; U205.41 U205.41 U205.41 ; 38.67,11.46 38.68,11.44 FPC2.6 ; U205.41 U205.41 U205.41 ; U205.41 U205.41 ; U15.15 52.45,19.99 ; 39.28,9.32 39.18,9.42 FPC2.5 ; FPC3.5 65.18,9.4 ; 52.53,22.63 52.46,22.55 U15.11 52.46,20.49 v1(52.21,20.24) 51.95,19.99 U15.3 51.95,17.89 51.8,17.73 ; FPC1.5 13.18,9.31 13.16,9.3 ; 15.17,9.4 15.18,9.41 FPC1.1 16.16,10.47 ; U205.41 U205.41 ; U205.41 U205.41 ; 64.9,9.68 64.68,9.91 FPC3.6 ; U205.41 U205.41 U205.41 ; FPC1.6 12.68,11.48 12.68,11.48
  Bottom Layer w1.016: 12.22,22.94 12.26,22.97 NOREF.43
  vias: v1(1.86,27.61) v1(2.42,26.19) v1(2.92,27.61) v1(6.03,23.9) v1(6.61,10.48) v1(7.04,23.27) v1(10.18,23.8) v1(11.65,23.8) v1(12.86,23.8) v1(14.21,23.8) v1(19.41,15.09) v1(19.59,13.51) v1(21.09,12.57) v1(21.09,11.74) v1(21.74,19.51) v1(22.01,26.1) v1(22.01,24.96) v1(22.03,27.2) v1(22.53,19.51) v1(23.23,27.2) v1(23.22,26.1) v1(23.22,24.96) v1(23.32,19.51) v1(24.11,19.51) v1(24.45,27.2) v1(24.45,26.1) v1(24.44,24.96) v1(24.7,18.37) v1(24.7,17.71) v1(24.9,19.51) v1(24.82,15.42) v1(25.13,14.61) v1(25.69,19.51) v1(25.62,15.19) v1(26.48,19.51) v1(27.27,19.51) v1(54.36,16.89) v1(54.36,15.81) v1(54.36,14.63) v1(70.65,27.6) v1(70.65,26.28) v1(70.65,24.96) v1(70.65,23.64) v1(70.65,22.32) v1(74.02,20.22) v1(75.34,20.22) v1(76.66,20.22) v1(77.98,20.22) v1(79.3,20.22) v1(80.62,20.22) v1(81.93,20.22) v1(83.25,20.22) v1(89.03,19.51) v1(97.57,20.35) v1(98.79,20.19) v1(98.79,18.8) v1(98.79,17.21)
VBAT: length 26.1
  Top Layer w0.508: v1(28.1,20.75) 28.1,16 v1(26.4,14.3) ; v1(29.47,23.12) v1(28.76,23.12) v1(27.87,23.12) 16.7,23.12 14.84,24.97 v1(14.84,27.51)
  Bottom Layer w0.508: v1(26.4,14.3) 26.35,14.25 Q1.3
  vias: v1(14.8,26.52) v1(14.8,25.54) v1(26.47,20.75) v1(27.24,20.75) v1(29.06,20.75)
VCC: length 132.2
  Top Layer w0.152: R11.2 78.32,11.7 v1(78.32,17.04)
  Top Layer w0.254: 29.19,11.3 29.19,12.17 v1(29.22,12.19) ; v1(73.26,17.3) 73.93,16.63 73.93,16.38
  Top Layer w0.508: 23.02,10.84 14.34,10.84 13.7,11.48 ; 23.02,10.84 27.39,10.84 ; 23.02,10.84 v1(23.02,12.04) v1(23.02,12.6) v1(23.02,13.16) v1(23.02,13.82) ; 27.39,10.84 27.86,11.3 v1(39.68,11.3) v1(54.01,11.3) v1(65.67,11.3) v1(68.79,11.3) 68.85,11.3 73.93,16.38 74.59,17.04 v1(78.32,17.04) ; 27.39,10.84 27.39,10.87
  Bottom Layer w0.203: 97.54,17.96 R5.2
  Bottom Layer w0.254: v1(65.67,11.3) 65.68,11.29 ; 65.68,11.29 FPC3.4 ; 65.68,11.29 65.69,11.28 66.05,11.28 66.18,11.15 FPC3.3 ; U15.7 49.19,20.49 C35.1 49.68,20.99 U15.8 ; FPC2.3 40.18,11.11 39.99,11.3 v1(39.68,11.3) 39.68,10.47 FPC2.4 ; FPC1.3 14.18,11.03 v1(13.68,11.53) FPC1.4 ; R7.2 29.22,12.19 v1(29.22,12.19) ; v1(73.26,17.3) 73.24,17.32 R3.2
  Bottom Layer w0.305: v1(54.01,11.3) 55.03,11.3 R8.2
  Bottom Layer w0.381: 47.73,18.32 47.73,17.53 48.6,16.66 R43.2 51.79,16.12 52.74,15.18 v1(52.74,11.33) ; 47.73,18.32 R42.2 ; 47.73,18.32 47.49,18.56 C34.2 49.17,20.48 C35.1
  Bottom Layer w0.508: 22.05,13.86 22.1,13.82 v1(23.02,13.82) ; LDO1.5 22.05,13.59 ; 97.54,17.96 95.75,17.96 95.72,17.99 92.9,17.99 91.68,16.77 84.26,16.77 83.57,17.45 78.75,17.45 78.34,17.04
AUDIO_SD: length 30.1
  Top Layer w0.152: v1(50.76,18.16) 54.39,18.16 55.07,18.85 62.77,18.85 64.93,16.69 67.5,16.69 v1(67.67,16.87)
  Bottom Layer w0.152: 51.23,18.16 51.2,18.14 R42.1 ; v1(67.67,16.87) 67.85,16.69 U205.38
  Bottom Layer w0.203: U15.4 51.45,18.39 51.23,18.16 v1(50.76,18.16)
BOOT: length 33.7
  Top Layer w0.152: v1(56.88,5.06) 57.13,5.31 74.87,5.31 75.39,4.79 v1(75.39,2.74)
  Bottom Layer w0.152: v1(56.88,5.06) 56.87,5.07 56.87,11.76 56.85,11.78 56.85,16.7 56.81,16.74 ; v1(75.39,2.74) 75.4,2.75 76.53,2.75
CC1: length 6.4
  Bottom Layer w0.152: USB2.A5 5.11,6.02 4.07,4.98 4.07,1.38 R1.1
CC2: length 7.3
  Bottom Layer w0.152: R2.1 3.35,9.56 3.9,9.02 USB2.B5
EC_A: length 20.1
  Top Layer w0.152: v1(92.51,15.77) 92.97,16.23 92.97,21.5
  Top Layer w0.203: R10.2 v1(80.83,15.42)
  Bottom Layer w0.152: 94.03,15.45 92.84,15.45 v1(92.51,15.77) 89.95,15.77 89.59,15.42 v1(80.83,15.42)
EC_B: length 23.8
  Top Layer w0.152: 87.89,21.5 87.89,19.79 89.06,18.61 v1(89.06,14.94)
  Top Layer w0.203: R9.2 v1(80.91,13.95)
  Bottom Layer w0.152: 94.03,11.64 90.6,11.64 89.06,13.18 v1(89.06,14.94) 81.9,14.94 v1(80.91,13.95)
EN: length 99.5
  Top Layer w0.152: v1(81.36,16.66) 81.36,16.71 78.72,19.36 71.2,19.36 68.82,21.74 6.81,21.74 v1(5.88,22.68)
  Bottom Layer w0.152: v1(81.36,16.66) 82.1,15.93 89.49,15.93 89.8,16.23 91.98,16.23 92.44,16.69 U205.3 ; v1(5.88,22.68) 3.72,24.83 SW104.D
  Bottom Layer w0.203: R5.1 96.14,16.2 C204.2 95.34,16.72 94.03,16.72
I2S_BCK: length 25.1
  Bottom Layer w0.152: U205.36 76.5,14.12 75.65,14.12 73.85,15.93 67.11,15.93 66,17.04 64.6,17.04 62.15,19.49 U15.16
I2S_DATA: length 26.3
  Bottom Layer w0.152: U205.35 75.7,12.88 74.99,13.6 74.99,14.07 73.54,15.52 66.84,15.52 65.72,16.64 64.27,16.64 62.17,18.74 U15.1
I2S_WS: length 24.9
  Bottom Layer w0.152: U15.14 55.31,20.49 55.94,19.86 62.57,19.86 64.96,17.48 66.23,17.48 67.39,16.31 74.51,16.31 75.42,15.39 76.5,15.39 U205.37
IO6: length 3.5
  Bottom Layer w0.254: R204.2 95.9,12.87 C205.2 95.87,12.91 94.03,12.91
IO13: length 82.8
  Top Layer w0.152: v1(83.29,4.45) 82.84,4.9 81.85,4.9 78.09,8.66 78.09,10.21 76.08,12.22 74.91,12.22 72.22,9.53 v1(64.22,9.53) v1(38.21,9.53) v1(12.2,9.53)
  Bottom Layer w0.152: U205.21 84.64,3.1 v1(83.29,4.45) ; v1(38.21,9.53) 38.18,9.56 FPC2.7 ; v1(12.2,9.53) 12.18,9.55 FPC1.7 ; v1(64.22,9.53) 64.18,9.57 FPC3.7
IO14: length 94.1
  Top Layer w0.152: v1(82.53,4.37) 81.8,4.37 77.71,8.46 77.71,10.03 76.77,10.97 v1(74.99,10.97) ; v1(62.16,6.25) v1(36.18,6.25) 36.13,6.3 10.22,6.3 v1(10.17,6.25)
  Bottom Layer w0.152: v1(62.16,6.25) 62.18,6.27 FPC3.11 62.18,11.17 62.82,11.81 69.07,11.81 69.75,12.5 73.87,12.5 74.99,11.38 v1(74.99,10.97) ; v1(82.53,4.37) 82.53,4.14 83.37,3.3 U205.22 ; 36.18,6.25 FPC2.11 ; v1(10.17,6.25) 10.18,6.26 FPC1.11
LCD_BL: length 12.3
  Top Layer w0.152: v1(82.1,2.57) 81.52,1.98 75.37,1.98 73.62,3.74 v1(73.62,4.47)
  Bottom Layer w0.203: R201.1 73.59,4.5 v1(73.62,4.47) ; U205.23 v1(82.1,2.57)
LEDK: length 59.5
  Top Layer w0.381: v1(71.54,10.39) v1(46.68,10.39) 28.23,10.39 27.92,10.09 v1(17.05,10.09)
  Bottom Layer w0.254: 72.64,10.39 Q200.3
  Bottom Layer w0.381: R205.1 17.42,10.09 v1(17.05,10.09) ; v1(46.68,10.39) 46.45,10.16 R206.1
  Bottom Layer w0.508: R207.1 v1(71.54,10.39) 72.64,10.39
MOSI: length 72.6
  Top Layer w0.152: v1(10.68,8.51) 10.7,8.48 v1(36.69,8.48) v1(62.67,8.48) 72.27,8.48 74.15,10.36 v1(75.45,10.36)
  Bottom Layer w0.152: v1(36.69,8.48) 36.68,8.49 FPC2.10 ; FPC1.10 10.68,10.47 v1(10.68,8.51) 10.68,8.46 ; v1(62.67,8.48) 62.68,8.49 FPC3.10 ; v1(75.45,10.36) 75.47,10.34 U205.33
OLED_CS1: length 67.8
  Top Layer w0.152: v1(75.42,9.07) 73.39,9.07 72.32,8 v1(11.69,8)
  Bottom Layer w0.152: U205.32 76.52,9.07 v1(75.42,9.07) ; FPC1.8 11.68,8.02 v1(11.69,8)
OLED_CS2: length 41.9
  Top Layer w0.152: v1(37.68,7.52) 72.52,7.52 72.83,7.82 v1(75.42,7.82)
  Bottom Layer w0.152: FPC2.8 37.68,7.52 v1(37.68,7.52) ; U205.31 75.44,7.8 v1(75.42,7.82)
OLED_CS3: length 24
  Top Layer w0.152: v1(63.69,6.22) 77.17,6.22 80.81,2.59 v1(80.81,2.52)
  Bottom Layer w0.152: U205.24 80.83,2.49 v1(80.81,2.52) ; FPC3.8 63.68,6.23 v1(63.69,6.22)
SCLK: length 70.8
  Top Layer w0.152: v1(75.45,11.61) 74.84,11.61 72.25,9.02 v1(63.18,9.02) v1(37.17,9.02) v1(11.18,9.02)
  Bottom Layer w0.152: U205.34 76.52,11.61 v1(75.45,11.61) ; v1(37.17,9.02) 37.18,9.03 FPC2.9 ; v1(11.18,9.02) 11.18,9.02 FPC1.9 ; 63.18,9.02 FPC3.9
SW01: length 77.6
  Top Layer w0.152: v1(74.75,18.83) 71.09,18.83 68.54,21.39 6.71,21.39 5.75,20.42 v1(5.75,19.79)
  Bottom Layer w0.152: v1(5.75,19.79) 5.73,19.77 C5.2 4.91,16.84 MX1.COL ; 76.53,17.99 74.82,17.99 R3.1 v1(74.75,18.83)
SW02: length 60.4
  Top Layer w0.152: v1(79.53,2.49) 79.53,3.18 77.1,5.61 34.5,5.61 v1(34.42,5.69)
  Bottom Layer w0.152: MX2.COL 30.81,14.03 31.68,13.16 31.68,8.43 v1(34.42,5.69) ; v1(79.53,2.49) 79.56,2.47 U205.25
SW04: length 16.2
  Top Layer w0.152: 87.89,7.73 87.92,7.7 SW102.E ; 87.89,7.73 87.1,8.51 83.27,8.51 82.99,8.79 79.72,8.79 R11.1 ; 87.89,7.73 87.89,5.26 v1(87.89,5.26)
  Bottom Layer w0.152: v1(87.89,5.26) 89.72,3.43 89.72,1.47
USBDM: length 113.4
  Top Layer w0.152: v1(92.82,3.81) 81.47,3.81 78.24,7.04 8.24,7.04 v1(8.14,6.94)
  Bottom Layer w0.152: USB2.A7 7.66,7.52 ; 7.66,7.52 7.66,8.11 8.29,8.74 8.29,11.23 6,13.51 6,14.48 6.87,15.34 6.87,20.65 8.59,22.38 8.59,23.8 9.72,24.93 NOREF#6.43 ; 7.66,7.52 8.14,7.04 v1(8.14,6.94) 7.72,6.52 USB2.B7 ; 94.23,4.02 93.03,4.02 v1(92.82,3.81)
USBDP: length 115.4
  Top Layer w0.152: v1(92.92,2.92) 92.46,3.38 81.36,3.38 78.01,6.73 9.02,6.73 8.74,6.45 7.89,6.45 v1(7.32,7.02)
  Bottom Layer w0.152: v1(7.32,7.02) USB2.A6 5.31,7.02 4.99,7.34 4.99,7.85 5.14,8 6.31,8 USB2.B6 7.11,8.02 7.98,8.89 7.98,11.08 5.67,13.39 5.67,14.58 6.56,15.47 6.56,20.8 8.26,22.51 8.26,23.79 7.18,24.87 NOREF#5.42 ; v1(92.92,2.92) 93.09,2.75 94.23,2.75
VN: length 2.1
  Bottom Layer w0.203: L3.1 51.96,23.23 U15.10
VON: length 4.8
  Bottom Layer w0.381: L3.2 56.15,25.04 NOREF#9.2
VOP: length 4.5
  Bottom Layer w0.381: NOREF#4.1 47.23,25.06 L4.2
VP: length 2.2
  Bottom Layer w0.203: L4.1 51.46,23.06 U15.9
VSYS: length 20
  Top Layer w0.254: v1(19.01,12.24) 19.01,13.84 20.17,15.01 23.45,15.01 25.36,13.11 v1(25.36,12.42)
  Bottom Layer w0.254: Q1.2 25.36,11.33 v1(25.36,12.42) ; v1(19.01,12.24) 19.01,10.67 LDO1.3
  Bottom Layer w0.508: Q1.2 25.4,9.93 D1.1 25.17,9.06 23.91,7.8 C1.2
VUSB: length 75.5
  Top Layer w0.508: v1(4.64,27.45) v1(4.64,26.52) v1(4.64,25.65) 3.84,24.85 3.84,15.47 7.37,11.94 v1(7.37,9.65) 6.61,8.89 6.61,5.56 v1(7.32,4.85)
  Bottom Layer w0.254: LED1.1 31.2,25.48 31.2,20.65 28.76,18.21 U1.4 ; 6.68,4.72 USB2.A4 ; 6.71,5.02 USB2.B9
  Bottom Layer w0.305: USB2.A9 7.21,9.82 v1(7.37,9.65) 7.24,9.52 USB2.B4 ; 6.71,5.02 7.16,5.02 v1(7.32,4.85) 7.19,4.72 6.68,4.72
  Bottom Layer w0.508: v1(7.32,4.85) 7.98,5.51 24.16,5.51 25.74,7.09 25.74,8 27.44,9.7 D1.2 27.52,11.07 Q1.1 27.3,15.94 26.62,16.62 C11.2 25.62,16.71 U1.4
$1N48640: length 1.7
  Bottom Layer w0.508: R208.2 23.72,18.26 U1.5
$1N76182: length 1.8
  Bottom Layer w0.508: R16.1 23.72,20.76 U1.1
$1N95276: length 3
  Bottom Layer w0.508: Q200.1 73.68,7.09 R201.2 R202.2
$1N109191: length 2.4
  Bottom Layer w0.203: U15.2 52.45,17.51 R43.1
$1N112073: length 17.5
  Top Layer w0.254: v1(21.22,22.28) v1(32.01,22.28)
  Bottom Layer w0.254: LED1.2 33.25,25.83 32.65,25.83 32.01,25.2 v1(32.01,22.28) ; R16.2 21.99,22.28 v1(21.22,22.28)
$1N122714: length 4.5
  Bottom Layer w0.254: FPC3.2 66.68,9.79 67.14,9.32 69.72,9.32 R207.2
$1N122760: length 4.2
  Bottom Layer w0.254: FPC2.2 40.68,9.84 41.1,9.42 41.94,9.42 42.67,10.16 43.82,10.16
$1N122794: length 4.3
  Bottom Layer w0.254: R205.2 15.42,12.01 14.68,11.27 FPC1.2

## Copper pours and planes (outline as drawn; the poured copper is in the pictures)
GND on Top Layer: -3.42,32.89 104.96,32.89 104.96,-3.78 -3.42,-3.78
GND on Bottom Layer: -3.62,29.97 110.93,29.97 110.93,-1.37 -3.62,-1.37
GND on Bottom Layer: 21.01,20.91 28.66,20.91 28.66,18.92 21.01,18.92
GND on Bottom Layer: 17.79,27.71 24.94,27.71 24.94,20.31 17.79,20.31
GND on Bottom Layer: 18.75,15.32 21.44,15.32 21.44,6.22 18.75,6.22
VBAT on Bottom Layer: 25.36,27.69 29.8,27.69 29.8,20.31 25.36,20.31
VCC on Bottom Layer: 21.72,15.34 23.4,15.34 23.4,11.36 21.72,11.36
(no net) on Bottom Layer: 19.44,12.88 20.45,12.88 20.45,10.99 19.44,10.99
VSYS on Bottom Layer: 21.73,10.09 23.43,10.09 23.43,6.21 21.73,6.21
VSYS on Bottom Layer: 18.78,10.62 20.45,10.62 20.45,8.92 18.78,8.92

Small or netless copper shapes (teardrops, artwork), in the pictures only: 1 on Bottom Layer

## Text on the board
Bottom Silkscreen Layer: 5V | D+ | D- | GND | BATT | speaker | JLCJLCJLCJLC | charger | B+ | B- | sp+ | sp-
Document Layer: 板厚 1.6mm
Top Solder Mask Layer: CC BY-NC-SA 4.0 | 20231115
Top Silkscreen Layer: https://oshwhub.com/kakaka | ThreePlus 2.4
